# Altium schematic sheet LCs.SchDoc
size Letter; DrawnBy: Adam Gilbert; Organization: Altium Limited; Address1: L3, 12a Rodborough Rd; Address2: Frenchs Forest; Address3: NSW; Address4: Australia 2086; DocumentNumber: 4; SheetNumber: 4; SheetTotal: 4
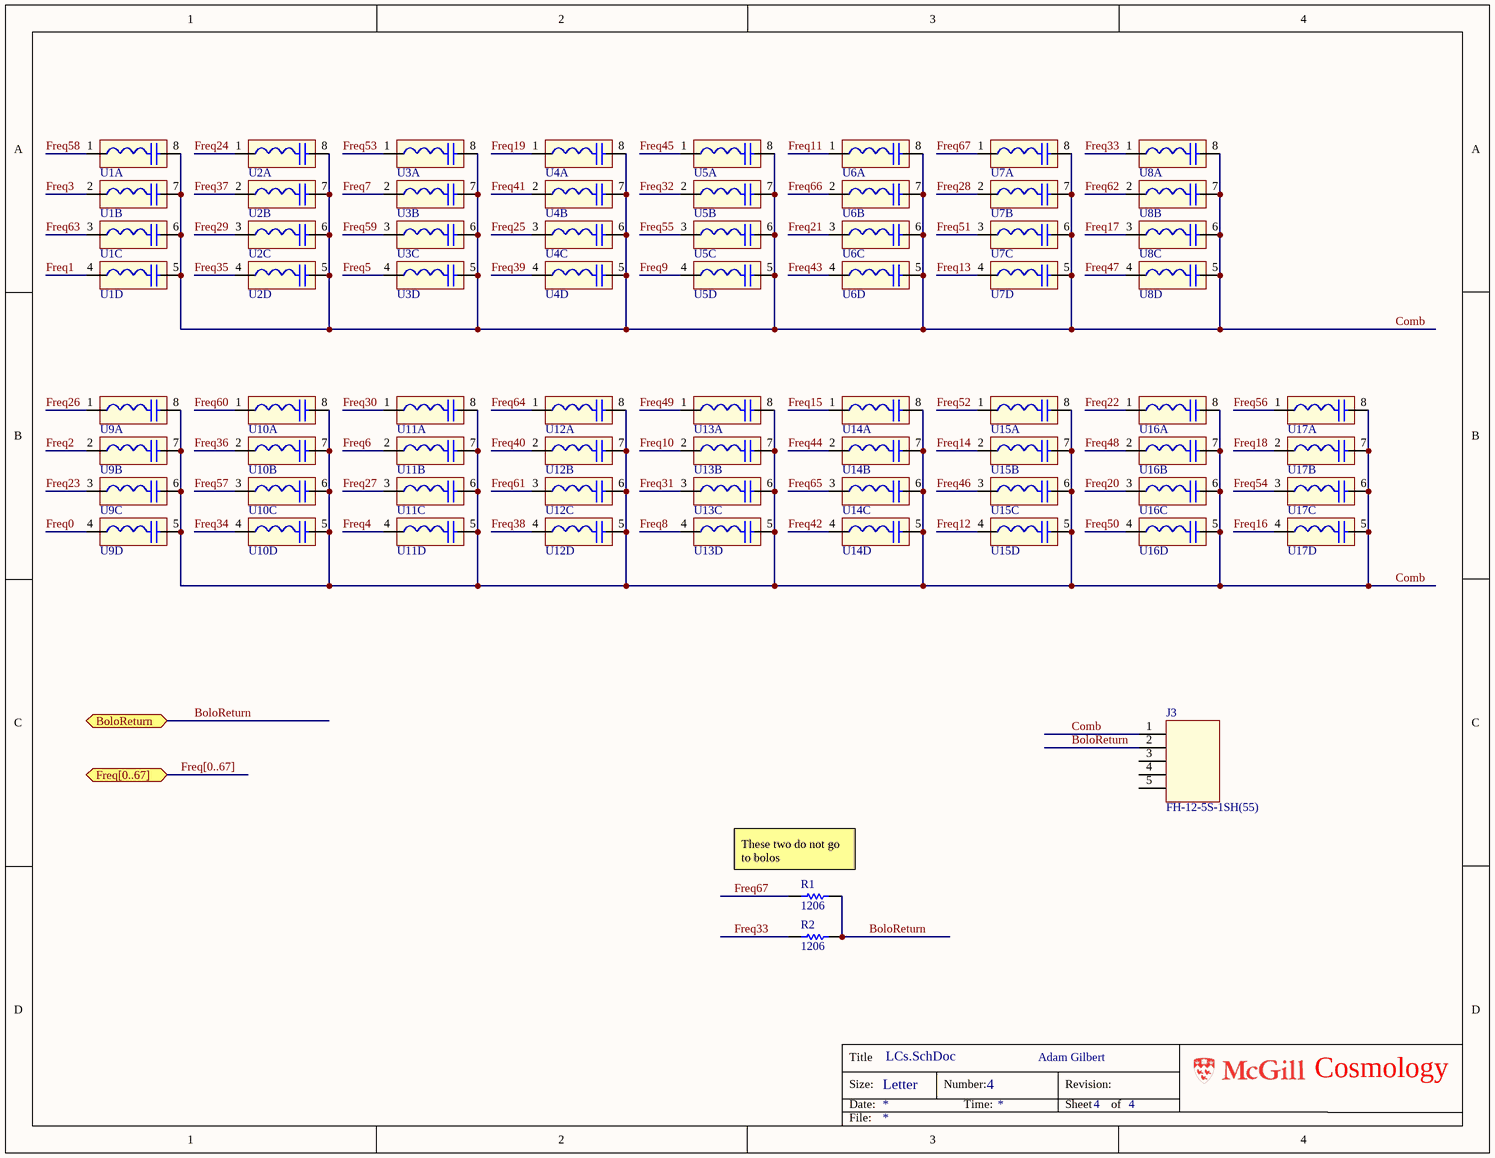
[diagram p0: LCs.SchDoc]

## Parts
J3  FH-12-5S-1SH(55)  [FH-12-5S-1SH(55)]
R1  Res1206  [1206]  (value not drawn)
R2  Res1206  [1206]  (value not drawn)
U1  LC_wafer  [LCCHIP4X2 - BondPads1]  (value not drawn)  (parts A,B,C,D of 4)
U2  LC_wafer  [LCCHIP4X2 - BondPads1]  (value not drawn)  (parts A,B,C,D of 4)
U3  LC_wafer  [LCCHIP4X2 - BondPads1]  (value not drawn)  (parts A,B,C,D of 4)
U4  LC_wafer  [LCCHIP4X2 - BondPads1]  (value not drawn)  (parts A,B,C,D of 4)
U5  LC_wafer  [LCCHIP4X2 - BondPads1]  (value not drawn)  (parts A,B,C,D of 4)
U6  LC_wafer  [LCCHIP4X2 - BondPads1]  (value not drawn)  (parts A,B,C,D of 4)
U7  LC_wafer  [LCCHIP4X2 - BondPads1]  (value not drawn)  (parts A,B,C,D of 4)
U8  LC_wafer  [LCCHIP4X2 - BondPads1]  (value not drawn)  (parts A,B,C,D of 4)
U9  LC_wafer  [LCCHIP4X2 - BondPads1]  (value not drawn)  (parts A,B,C,D of 4)
U10  LC_wafer  [LCCHIP4X2 - BondPads1]  (value not drawn)  (parts A,B,C,D of 4)
U11  LC_wafer  [LCCHIP4X2 - BondPads1]  (value not drawn)  (parts A,B,C,D of 4)
U12  LC_wafer  [LCCHIP4X2 - BondPads1]  (value not drawn)  (parts A,B,C,D of 4)
U13  LC_wafer  [LCCHIP4X2 - BondPads1]  (value not drawn)  (parts A,B,C,D of 4)
U14  LC_wafer  [LCCHIP4X2 - BondPads1]  (value not drawn)  (parts A,B,C,D of 4)
U15  LC_wafer  [LCCHIP4X2 - BondPads1]  (value not drawn)  (parts A,B,C,D of 4)
U16  LC_wafer  [LCCHIP4X2 - BondPads1]  (value not drawn)  (parts A,B,C,D of 4)
U17  LC_wafer  [LCCHIP4X2 - BondPads1]  (value not drawn)  (parts A,B,C,D of 4)

## Ports
BoloReturn, Freq[0..67]

## Nets
BoloReturn: J3.2 R1.2 R2.2 ; port BoloReturn
Comb: J3.1 U1.5 U1.6 U1.7 U1.8 U2.5 U2.6 U2.7 U2.8 U3.5 U3.6 U3.7 U3.8 U4.5 U4.6 U4.7 U4.8 U5.5 U5.6 U5.7 U5.8 U6.5 U6.6 U6.7 U6.8 U7.5 U7.6 U7.7 U7.8 U8.5 U8.6 U8.7 U8.8 U9.5 U9.6 U9.7 U9.8 U10.5 U10.6 U10.7 U10.8 U11.5 U11.6 U11.7 U11.8 U12.5 U12.6 U12.7 U12.8 U13.5 U13.6 U13.7 U13.8 U14.5 U14.6 U14.7 U14.8 U15.5 U15.6 U15.7 U15.8 U16.5 U16.6 U16.7 U16.8 U17.5 U17.6 U17.7 U17.8
Freq0: U9.4
Freq1: U1.4
Freq2: U9.2
Freq3: U1.2
Freq4: U11.4
Freq5: U3.4
Freq6: U11.2
Freq7: U3.2
Freq8: U13.4
Freq9: U5.4
Freq10: U13.2
Freq11: U6.1
Freq12: U15.4
Freq13: U7.4
Freq14: U15.2
Freq15: U14.1
Freq16: U17.4
Freq17: U8.3
Freq18: U17.2
Freq19: U4.1
Freq20: U16.3
Freq21: U6.3
Freq22: U16.1
Freq23: U9.3
Freq24: U2.1
Freq25: U4.3
Freq26: U9.1
Freq27: U11.3
Freq28: U7.2
Freq29: U2.3
Freq30: U11.1
Freq31: U13.3
Freq32: U5.2
Freq33: R2.1 U8.1
Freq34: U10.4
Freq35: U2.4
Freq36: U10.2
Freq37: U2.2
Freq38: U12.4
Freq39: U4.4
Freq40: U12.2
Freq41: U4.2
Freq42: U14.4
Freq43: U6.4
Freq44: U14.2
Freq45: U5.1
Freq46: U15.3
Freq47: U8.4
Freq48: U16.2
Freq49: U13.1
Freq50: U16.4
Freq51: U7.3
Freq52: U15.1
Freq53: U3.1
Freq54: U17.3
Freq55: U5.3
Freq56: U17.1
Freq57: U10.3
Freq58: U1.1
Freq59: U3.3
Freq60: U10.1
Freq61: U12.3
Freq62: U8.2
Freq63: U1.3
Freq64: U12.1
Freq65: U14.3
Freq66: U6.2
Freq67: R1.1 U7.1

Not connected (* = marked no-connect by the designer): J3 3 4 5

## Buses and harness runs
bus Freq[0..67] = port Freq[0..67]

## Notes on the sheet
- (near R1) These two do not go to bolos
- Title
- Size:
- Date:
- Letter
- Number:
- Time:
- Revision:
- Sheet
- of
- Cosmology
- File:

## Library data of the parts
R1 R2 = Res1206: Resistor; Param1: 100ppm/C; Value: DNL; Param: 1%; TechInfo: *
U1-U17 = LCWafer: Gold bonded integrated LC